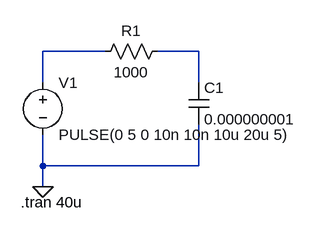
[diagram p0: schematic R = 1K, C = 10^-9.asc]
R = 1K, C = 10^-9.asc, the LTspice schematic file:
Version 4
SHEET 1 880 680
WIRE 128 80 32 80
WIRE 272 80 208 80
WIRE 32 128 32 80
WIRE 272 128 272 80
WIRE 32 256 32 208
WIRE 272 256 272 192
WIRE 272 256 32 256
WIRE 32 288 32 256
FLAG 32 288 0
SYMBOL voltage 32 112 R0
WINDOW 123 0 0 Left 0
WINDOW 39 0 0 Left 0
SYMATTR InstName V1
SYMATTR Value PULSE(0 5 0 10n 10n 10u 20u 5)
SYMBOL res 224 64 R90
WINDOW 0 0 56 VBottom 2
WINDOW 3 32 56 VTop 2
SYMATTR InstName R1
SYMATTR Value 1000
SYMBOL cap 256 128 R0
SYMATTR InstName C1
SYMATTR Value 0.000000001
TEXT -2 312 Left 2 !.tran 40u

The netlist it stands for:
* R = 1K, C = 10^-9.asc
V1 N001 0 PULSE(0 5 0 10n 10n 10u 20u 5)
R1 N002 N001 1000
C1 N002 0 0.000000001
.tran 40u
.backanno
.end